# Altium schematic sheet RadarOscillator.SchDoc
size A; SheetNumber: 3; SheetTotal: 5
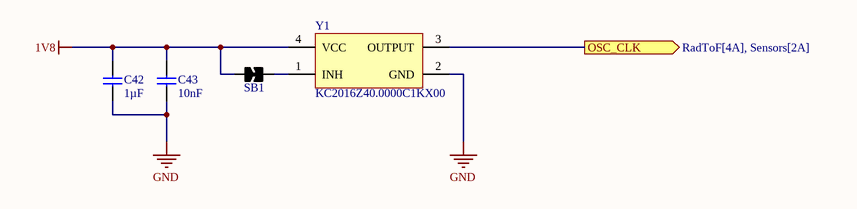
[diagram p0: RadarOscillator.SchDoc]

## Parts
C42  value 1µF  [CAP0402]  (hidden comment: C_GRM155R61E105KA12J)
C43  value 10nF  [CAP0201]  (hidden comment: C_GRM033R70J103JA01D)
SB1  SB2_0402_close  [SB2_0402_CLOSE]  (value not drawn)  (net tie)
Y1  KC2016Z40.0000C1KX00  [KC2016Z_AVX]

## Ports
OSC_CLK (out, see RadToF[4A], Sensors[2A])

## Nets
1V8: C42.2 C43.2 SB1.2 Y1.4(VCC)
GND: C42.1 C43.1 Y1.2(GND)
OSC_CLK: Y1.3(OUTPUT) ; port OSC_CLK
NetSB1_1: SB1.1 Y1.1(INH)

## Library data of the parts
C42 = CMP-001-00102-1: CAP CER 1uF 25V X5R 0402; Manufacturer Part Number: GRM033R61A105ME15D; Manufacturer: Murata; Positive Tolerance: 10%; Voltage Rating (DC): 10V; Dielectric Material: Ceramic; Multilayer: Yes; Tolerance: 20%; Pricing 1: 1=0.18000, 10=0.08400, 50=0.08400, 100=0.03800, 1000=0.02100, 10000=0.01600 (USD); Pins: 2; Termination: Wraparound; Thickness: 0.015inch; Case Code (Metric): 0603; Packaging: Tape and Reel; Temperature Characteristics Code: X5R; Package Shape: Rectangular; ComponentLink2Description: https://datasheet.ciiva.com:443/pdfs/VipMasterIC/IC/MURE/MURE-S-A0004362469/MURE-S-A0004364524-1.pdf?src-supplier=IHS+Markit; ComponentLink1URL: http://search.murata.co.jp/Ceramy/image/img/A01X/G101/ENG/GRM033R61A105ME15-01.pdf?src-supplier=Digi-Key; Case/Package: 0201; Terminal Finish: Nickel; Height: 0.5mm; ComponentLink2URL: https://datasheet.ciiva.com:443/pdfs/VipMasterIC/IC/MURE/MURE-S-A0004362469/MURE-S-A0004364524-1.pdf?src-supplier=IHS+Markit; ComponentLink3URL: http://search.murata.co.jp/Ceramy/image/img/A01X/G101/ENG/GRM155R61E105KA12-01.pdf?src-supplier=Digi-Key; Size Code: 0402; Source: schuluka.SchLib; Max Operating Temperature: 85°C; Category: Ceramic Capacitors; Width: 0.012inch; REACH SVHC: Yes; Min Operating Temperature: -55°C; Dielectric: X5R; ComponentLink3Description: http://search.murata.co.jp/Ceramy/image/img/A01X/G101/ENG/GRM155R61E105KA12-01.pdf?src-supplier=Digi-Key; Mount: Surface Mount; Rated DC Voltage (URdc): 25V; Stock 1: 645001; Voltage Rating: 10V; RoHS Compliant: Yes; Design Item ID: C_GRM155R61E105KA12J; Capacitor Type: Ceramic; JESD-609 Code: e3; RoHS: Yes; ComponentLink1Description: http://search.murata.co.jp/Ceramy/image/img/A01X/G101/ENG/GRM033R61A105ME15-01.pdf?src-supplier=Digi-Key; Package Style: SMTMeter; Negative Tolerance: 10%; Length: 0.024inch
C43 = CMP-001-00093-1: CAP CER 10nF 6.3V X7R 0201; Manufacturer: Murata Electronics; Tolerance: 5%; Size / Dimension: 0.024" L x 0.012" W (0.60mm x 0.30mm); Mounting Type: Surface Mount, MLCC; Package / Case: 0201 (0603 Metric); ComponentLink2URL: http://digikey.com/product-detail/en/murata-electronics/GRM033R70J103JA01D/490-16599-1-ND/7595523; Series: GRM; Lifecycle Status: Active; LastUpdated: 02/09/2020 01:00:04; Operating Temperature: -55°C ~ 125°C; Temperature Coefficient: X7R; Device Package: 0201 (0603 Metric); ComponentLink2Description: DigiKey Link; PartId: 174; Minimum Order: 1; Design Item ID: C_GRM033R70J103JA01D; ComponentLink1URL: https://search.murata.co.jp/Ceramy/image/img/A01X/G101/ENG/GRM033R70J103JA01-01.pdf; Applications: General Purpose; Source: schuluka.SchLib; Thickness (Max): 0.013" (0.33mm); Voltage - Rated: 6.3V; Part Status: Active; Price: 0.10; Packaging: CutTape; Part Number: GRM033R70J103JA01D; ComponentLink1Description: Datasheet
SB1 = JUMP_SB2_0402_close: Custom Solder jumper, closed
Y1 = X_KC2016Z40.0000C1KX00: Standard Clock Oscillators 40 Mhz 20 Ppm 15 Pf Cmos Aec-Q200; Mfr_Name: KYOCERA AVX; Copyright: Copyright (C) 2022 Ultra Librarian. All rights reserved.; RefDes: RefDes; Type: DEV; Supplier 1: Digi-Key; Supplier Part Number 1: 478-KC2016Z40.0000C1KX00CT-ND; Manufacturer: Kyocera AVX; Manufacturer Part Number: KC2016Z40.0000C1KX00; RoHS: No; Category: Oscillators; Stock 1: 1950; Pricing 1: 1=1.29000, 10=1.13800, 50=1.06420, 100=0.94050, 500=0.89100, 1000=0.74250 (USD)